# Altium schematic sheet DiseñoAlimentación.SchDoc
size A4; SheetNumber: 1; SheetTotal: 1
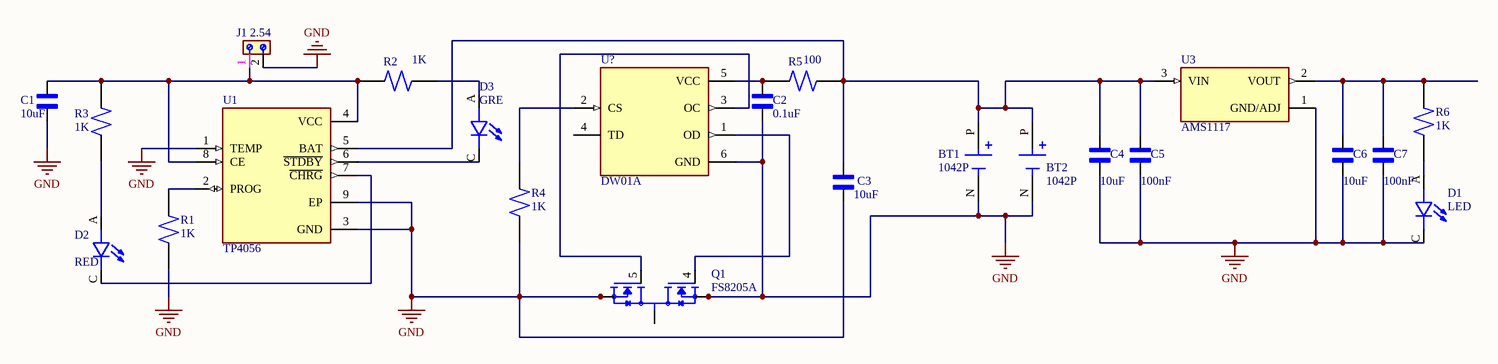
[diagram p0: DiseñoAlimentación.SchDoc]

## Parts
BT1  1042P  [BAT_1042P]
BT2  1042P  [BAT_1042P]
C1  10uF  [CAPC2012X94N]
C2  0.1uF  [CAPC2012X94N]
C3  10uF  [CAPC2012X94N]
C4  10uF  [CAPC2012X94N]
C5  100nF  [CAPC2012X94N]
C6  10uF  [CAPC2012X94N]
C7  100nF  [CAPC2012X94N]
D1  LED  [LEDC2012X120N]
D2  RED  [LEDC2012X120N]
D3  GRE  [LEDC2012X120N]
J1  2.54  [691210910002]
Q1  FS8205A  [SOP65P640X120-8N]
R1  1K  [RESC2012X60N]
R2  1K  [RESC2012X60N]
R3  1K  [RESC2012X60N]
R4  1K  [RESC2012X60N]
R5  100  [RESC2012X60N]
R6  1K  [RESC2012X60N]
U1  TP4056  [SOP127P600X175-9N]
U3  AMS1117  [SOT229P700X180-4N]
U?  DW01A  [SOT95P280X145-6N]

## Nets
GND: BT1.N(NEG) BT2.N(NEG) C1.1 C2.2 C3.1 C4.1 C5.1 C6.1 C7.1 D1.C J1.2 Q1.2(S1) Q1.3(S1) Q1.6(S2) Q1.7(S2) R1.1 R4.1 U1.1(TEMP) U1.3(GND) U1.9(EP) U3.1(GND/ADJ) U?.6(GND)
NetBT1_P: BT1.P(POS) BT2.P(POS) C3.2 C4.2 C5.2 R5.2 U1.5(BAT) U3.3(VIN)
NetC1_2: C1.2 J1.1 R2.1 R3.2 U1.4(VCC) U1.8(CE)
NetC2_1: C2.1 R5.1 U?.5(VCC)
NetC6_2: C6.2 C7.2 R6.2 U3.2(VOUT)
NetD1_A: D1.A R6.1
NetD2_A: D2.A R3.1
NetD2_C: D2.C U1.7(~{CHRG})
NetD3_A: D3.A R2.2
NetD3_C: D3.C U1.6(~{STDBY})
NetQ1_1: Q1.1(D12) Q1.8(D12)
NetQ1_4: Q1.4(G1) U?.1(OD)
NetQ1_5: Q1.5(G2) U?.3(OC)
NetR1_2: R1.2 U1.2(PROG)
NetR4_2: R4.2 U?.2(CS)

Not connected (* = marked no-connect by the designer): U? 4(TD)

## Library data of the parts
BT1 BT2 = 1042P: SMT Polarized Holder for 18650 Battery; MF: Keystone Electronics; Price: None; Purchase-URL: https://pricing.snapeda.com/search/part/1042P/?ref=eda; Check_prices: https://www.snapeda.com/parts/1042P/Keystone+Electronics/view-part/?ref=eda; Value: *; SnapEDA_Link: https://www.snapeda.com/parts/1042P/Keystone+Electronics/view-part/?ref=snap; Availability: In Stock; MP: 1042P; Package: None
C1-C7 = 0805YC103J4T2A: 10000 pF Â±5% 16V Ceramic Capacitor X7R 0805 (2012 Metric); MF: AVX; SnapEDA_Link: https://www.snapeda.com/parts/0805YC103J4T2A/AVX/view-part/?ref=snap; Package: 2012 AVX; Value: *; MP: 0805YC103J4T2A; Check_prices: https://www.snapeda.com/parts/0805YC103J4T2A/AVX/view-part/?ref=eda
D1-D3 = SML-LXT0805IW-TR: LED;Red;11mcd;0.061In.Dia.;SMD;100mA;2V Vf;635nm;140deg;SMD;White Diffused;5V Vr | Lumex SML-LXT0805IW-TR; MF: Lumex Opto/Components; SnapEDA_Link: https://www.snapeda.com/parts/SML-LXT0805IW-TR/Lumex+Opto%252FComponents+Inc./view-part/?ref=snap; Package: 0805 Lumex; Value: *; MP: SML-LXT0805IW-TR; Check_prices: https://www.snapeda.com/parts/SML-LXT0805IW-TR/Lumex+Opto%252FComponents+Inc./view-part/?ref=eda
J1 = 691210910002: MF: {'manufacturer': u'W\xfcrth Elektronik'}; Package: None; Price: None; Value: *; MP: 691210910002; Availability: Unavailable
Q1 = FS8205A: MF: Fortune Semiconductor; SnapEDA_Link: https://www.snapeda.com/parts/FS8205A/Fortune+Semiconductor/view-part/?ref=snap; Package: Package; Value: *; MP: FS8205A; Check_prices: https://www.snapeda.com/parts/FS8205A/Fortune+Semiconductor/view-part/?ref=eda
R1-R6 = RC0805FR-07910RL: 910 Ohms Â±1% 0.125W, 1/8W Chip Resistor 0805 (2012 Metric) Moisture Resistant Thick Film; MF: Yageo; Package: 2012 Rohm Semiconductor; Value: *; Purchase-URL: https://pricing.snapeda.com/search/part/RC0805FR-07910RL/?ref=eda; Availability: In Stock; MP: RC0805FR-07910RL; Price: None
U1 = TP4056: Complete single cell Li-Ion battery with a constant current / constant voltage linear charger; MF: NanJing Top Power ASIC Corp.; Check_prices: https://www.snapeda.com/parts/TP4056/NanJing+Top+Power+ASIC+Corp./view-part/?ref=eda; SnapEDA_Link: https://www.snapeda.com/parts/TP4056/NanJing+Top+Power+ASIC+Corp./view-part/?ref=snap; Price: None; Availability: Not in stock; Package: Package; MP: TP4056; Value: *
U3 = AMS1117-3.3: LDO Voltage Regulators 800MA LDO LINEAR REG; MF: ams AG; SnapEDA_Link: https://www.snapeda.com/parts/AMS1117-3.3/ams/view-part/?ref=snap; Package: SOT-223 Seeed Technology; Value: *; MP: AMS1117-3.3; Check_prices: https://www.snapeda.com/parts/AMS1117-3.3/ams/view-part/?ref=eda
U? = DW01A: One Cell Lithium-ion/Polymer Battery Protection IC; MF: Fortune Semiconductor; SnapEDA_Link: https://www.snapeda.com/parts/DW01A/Fortune+Semiconductor/view-part/?ref=snap; Package: SOT-23-6 Fortune Semiconductor; Value: *; MP: DW01A; Check_prices: https://www.snapeda.com/parts/DW01A/Fortune+Semiconductor/view-part/?ref=eda